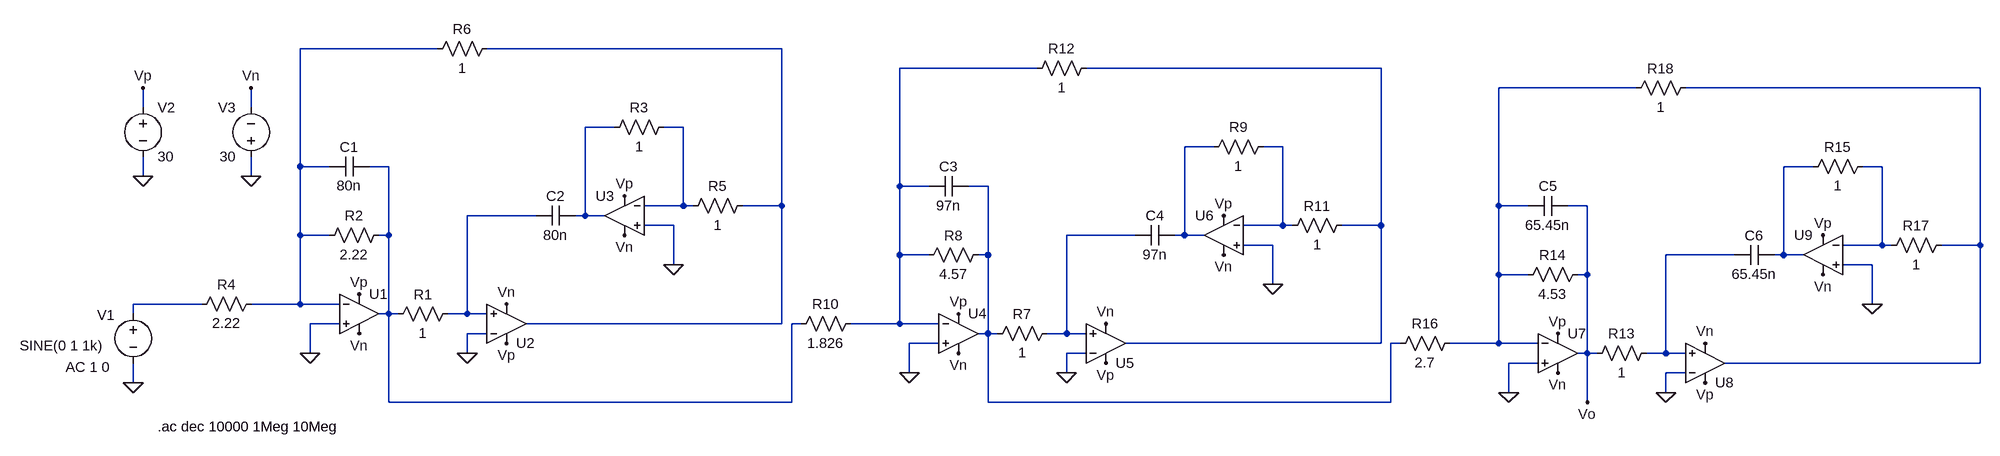
[diagram p0: schematic EJ8.asc]
EJ8.asc, the LTspice schematic file:
Version 4
SHEET 1 2768 680
WIRE 224 -240 0 -240
WIRE 784 -240 304 -240
WIRE 1200 -208 976 -208
WIRE 1760 -208 1280 -208
WIRE 2176 -176 1952 -176
WIRE 2736 -176 2256 -176
WIRE -256 -144 -256 -176
WIRE -80 -144 -80 -176
WIRE 512 -112 464 -112
WIRE 624 -112 592 -112
WIRE 1488 -80 1440 -80
WIRE 1600 -80 1568 -80
WIRE 0 -48 0 -240
WIRE 48 -48 0 -48
WIRE 144 -48 112 -48
WIRE 2464 -48 2416 -48
WIRE 2576 -48 2544 -48
WIRE -256 -32 -256 -64
WIRE -80 -32 -80 -64
WIRE 976 -16 976 -208
WIRE 1024 -16 976 -16
WIRE 1120 -16 1088 -16
WIRE 624 16 624 -112
WIRE 624 16 560 16
WIRE 640 16 624 16
WIRE 784 16 784 -240
WIRE 784 16 720 16
WIRE 1952 16 1952 -176
WIRE 2000 16 1952 16
WIRE 2096 16 2064 16
WIRE 384 32 272 32
WIRE 464 32 464 -112
WIRE 464 32 448 32
WIRE 496 32 464 32
WIRE 608 48 560 48
WIRE 1600 48 1600 -80
WIRE 1600 48 1536 48
WIRE 1616 48 1600 48
WIRE 1760 48 1760 -208
WIRE 1760 48 1696 48
WIRE 0 64 0 -48
WIRE 48 64 0 64
WIRE 144 64 144 -48
WIRE 144 64 128 64
WIRE 1360 64 1248 64
WIRE 1440 64 1440 -80
WIRE 1440 64 1424 64
WIRE 1472 64 1440 64
WIRE 1584 80 1536 80
WIRE 2576 80 2576 -48
WIRE 2576 80 2512 80
WIRE 2592 80 2576 80
WIRE 2736 80 2736 -176
WIRE 2736 80 2672 80
WIRE 976 96 976 -16
WIRE 1024 96 976 96
WIRE 1120 96 1120 -16
WIRE 1120 96 1104 96
WIRE 2336 96 2224 96
WIRE 2416 96 2416 -48
WIRE 2416 96 2400 96
WIRE 2448 96 2416 96
WIRE 608 112 608 48
WIRE 2560 112 2512 112
WIRE 1952 128 1952 16
WIRE 2000 128 1952 128
WIRE 2096 128 2096 16
WIRE 2096 128 2080 128
WIRE 1584 144 1584 80
WIRE -160 176 -272 176
WIRE 0 176 0 64
WIRE 0 176 -80 176
WIRE 64 176 0 176
WIRE 2560 176 2560 112
WIRE -272 192 -272 176
WIRE 144 192 144 64
WIRE 144 192 128 192
WIRE 160 192 144 192
WIRE 272 192 272 32
WIRE 272 192 240 192
WIRE 304 192 272 192
WIRE 64 208 16 208
WIRE 784 208 784 16
WIRE 784 208 368 208
WIRE 816 208 800 208
WIRE 976 208 976 96
WIRE 976 208 896 208
WIRE 1040 208 976 208
WIRE 304 224 272 224
WIRE 1120 224 1120 96
WIRE 1120 224 1104 224
WIRE 1136 224 1120 224
WIRE 1248 224 1248 64
WIRE 1248 224 1216 224
WIRE 1280 224 1248 224
WIRE 1040 240 992 240
WIRE 1760 240 1760 48
WIRE 1760 240 1344 240
WIRE 1792 240 1776 240
WIRE 1952 240 1952 128
WIRE 1952 240 1872 240
WIRE 2016 240 1952 240
WIRE 16 256 16 208
WIRE 272 256 272 224
WIRE 1280 256 1248 256
WIRE 2096 256 2096 128
WIRE 2096 256 2080 256
WIRE 2112 256 2096 256
WIRE 2224 256 2224 96
WIRE 2224 256 2192 256
WIRE 2256 256 2224 256
WIRE 2016 272 1968 272
WIRE 2736 272 2736 80
WIRE 2736 272 2320 272
WIRE 992 288 992 240
WIRE 1248 288 1248 256
WIRE 2256 288 2224 288
WIRE -272 304 -272 272
WIRE 1968 320 1968 272
WIRE 2224 320 2224 288
WIRE 144 336 144 192
WIRE 800 336 800 208
WIRE 800 336 144 336
WIRE 1120 336 1120 224
WIRE 1776 336 1776 240
WIRE 1776 336 1120 336
WIRE 2096 336 2096 256
FLAG 16 256 0
FLAG 272 256 0
FLAG 608 112 0
FLAG -272 304 0
FLAG -256 -32 0
FLAG -80 -32 0
FLAG -256 -176 Vp
FLAG 96 160 Vp
FLAG 528 0 Vp
FLAG 336 240 Vp
FLAG 96 224 Vn
FLAG 528 64 Vn
FLAG 336 176 Vn
FLAG -80 -176 Vn
FLAG 992 288 0
FLAG 1248 288 0
FLAG 1584 144 0
FLAG 1072 192 Vp
FLAG 1504 32 Vp
FLAG 1312 272 Vp
FLAG 1072 256 Vn
FLAG 1504 96 Vn
FLAG 1312 208 Vn
FLAG 1968 320 0
FLAG 2224 320 0
FLAG 2560 176 0
FLAG 2048 224 Vp
FLAG 2480 64 Vp
FLAG 2288 304 Vp
FLAG 2048 288 Vn
FLAG 2480 128 Vn
FLAG 2288 240 Vn
FLAG 2096 336 Vo
SYMBOL OpAmps\\UniversalOpAmp 96 192 R0
SYMATTR InstName U1
SYMATTR Value2 Avol=1000000000Meg GBW=1000000000000Meg Vos=0
SYMATTR SpiceLine En=0 Enk=0 In=0 Ink=0 Rin=500000000Meg
SYMBOL OpAmps\\UniversalOpAmp 336 208 M180
SYMATTR InstName U2
SYMATTR Value2 Avol=1000000000Meg GBW=1000000000000Meg Vos=0
SYMATTR SpiceLine En=0 Enk=0 In=0 Ink=0 Rin=500000000Meg
SYMBOL OpAmps\\UniversalOpAmp 528 32 M0
SYMATTR InstName U3
SYMATTR Value2 Avol=1000000000Meg GBW=1000000000000Meg Vos=0
SYMATTR SpiceLine En=0 Enk=0 In=0 Ink=0 Rin=500000000Meg
SYMBOL res 256 176 R90
WINDOW 0 0 56 VBottom 2
WINDOW 3 32 56 VTop 2
SYMATTR InstName R1
SYMATTR Value 1
SYMBOL res 144 48 R90
WINDOW 0 0 56 VBottom 2
WINDOW 3 32 56 VTop 2
SYMATTR InstName R2
SYMATTR Value 2.22
SYMBOL cap 112 -64 R90
WINDOW 0 0 32 VBottom 2
WINDOW 3 32 32 VTop 2
SYMATTR InstName C1
SYMATTR Value 80n
SYMBOL cap 448 16 R90
WINDOW 0 0 32 VBottom 2
WINDOW 3 32 32 VTop 2
SYMATTR InstName C2
SYMATTR Value 80n
SYMBOL res 608 -128 R90
WINDOW 0 0 56 VBottom 2
WINDOW 3 32 56 VTop 2
SYMATTR InstName R3
SYMATTR Value 1
SYMBOL res -64 160 R90
WINDOW 0 0 56 VBottom 2
WINDOW 3 32 56 VTop 2
SYMATTR InstName R4
SYMATTR Value 2.22
SYMBOL res 736 0 R90
WINDOW 0 0 56 VBottom 2
WINDOW 3 32 56 VTop 2
SYMATTR InstName R5
SYMATTR Value 1
SYMBOL res 320 -256 R90
WINDOW 0 0 56 VBottom 2
WINDOW 3 32 56 VTop 2
SYMATTR InstName R6
SYMATTR Value 1
SYMBOL voltage -272 176 R0
WINDOW 0 -59 18 Left 2
WINDOW 3 -185 68 Left 2
WINDOW 123 -110 103 Left 2
WINDOW 39 0 0 Left 0
SYMATTR InstName V1
SYMATTR Value SINE(0 1 1k)
SYMATTR Value2 AC 1 0
SYMBOL voltage -256 -160 R0
WINDOW 123 0 0 Left 0
WINDOW 39 0 0 Left 0
SYMATTR InstName V2
SYMATTR Value 30
SYMBOL voltage -80 -48 R180
WINDOW 0 24 96 Left 2
WINDOW 3 24 16 Left 2
WINDOW 123 0 0 Left 0
WINDOW 39 0 0 Left 0
SYMATTR InstName V3
SYMATTR Value 30
SYMBOL OpAmps\\UniversalOpAmp 1072 224 R0
SYMATTR InstName U4
SYMATTR Value2 Avol=1000000000Meg GBW=1000000000000Meg Vos=0
SYMATTR SpiceLine En=0 Enk=0 In=0 Ink=0 Rin=500000000Meg
SYMBOL OpAmps\\UniversalOpAmp 1312 240 M180
SYMATTR InstName U5
SYMATTR Value2 Avol=1000000000Meg GBW=1000000000000Meg Vos=0
SYMATTR SpiceLine En=0 Enk=0 In=0 Ink=0 Rin=500000000Meg
SYMBOL OpAmps\\UniversalOpAmp 1504 64 M0
SYMATTR InstName U6
SYMATTR Value2 Avol=1000000000Meg GBW=1000000000000Meg Vos=0
SYMATTR SpiceLine En=0 Enk=0 In=0 Ink=0 Rin=500000000Meg
SYMBOL res 1232 208 R90
WINDOW 0 0 56 VBottom 2
WINDOW 3 32 56 VTop 2
SYMATTR InstName R7
SYMATTR Value 1
SYMBOL res 1120 80 R90
WINDOW 0 0 56 VBottom 2
WINDOW 3 32 56 VTop 2
SYMATTR InstName R8
SYMATTR Value 4.57
SYMBOL cap 1088 -32 R90
WINDOW 0 0 32 VBottom 2
WINDOW 3 32 32 VTop 2
SYMATTR InstName C3
SYMATTR Value 97n
SYMBOL cap 1424 48 R90
WINDOW 0 0 32 VBottom 2
WINDOW 3 32 32 VTop 2
SYMATTR InstName C4
SYMATTR Value 97n
SYMBOL res 1584 -96 R90
WINDOW 0 0 56 VBottom 2
WINDOW 3 32 56 VTop 2
SYMATTR InstName R9
SYMATTR Value 1
SYMBOL res 912 192 R90
WINDOW 0 0 56 VBottom 2
WINDOW 3 32 56 VTop 2
SYMATTR InstName R10
SYMATTR Value 1.826
SYMBOL res 1712 32 R90
WINDOW 0 0 56 VBottom 2
WINDOW 3 32 56 VTop 2
SYMATTR InstName R11
SYMATTR Value 1
SYMBOL res 1296 -224 R90
WINDOW 0 0 56 VBottom 2
WINDOW 3 32 56 VTop 2
SYMATTR InstName R12
SYMATTR Value 1
SYMBOL OpAmps\\UniversalOpAmp 2048 256 R0
SYMATTR InstName U7
SYMATTR Value2 Avol=1000000000Meg GBW=1000000000000Meg Vos=0
SYMATTR SpiceLine En=0 Enk=0 In=0 Ink=0 Rin=500000000Meg
SYMBOL OpAmps\\UniversalOpAmp 2288 272 M180
SYMATTR InstName U8
SYMATTR Value2 Avol=1000000000Meg GBW=1000000000000Meg Vos=0
SYMATTR SpiceLine En=0 Enk=0 In=0 Ink=0 Rin=500000000Meg
SYMBOL OpAmps\\UniversalOpAmp 2480 96 M0
SYMATTR InstName U9
SYMATTR Value2 Avol=1000000000Meg GBW=1000000000000Meg Vos=0
SYMATTR SpiceLine En=0 Enk=0 In=0 Ink=0 Rin=500000000Meg
SYMBOL res 2208 240 R90
WINDOW 0 0 56 VBottom 2
WINDOW 3 32 56 VTop 2
SYMATTR InstName R13
SYMATTR Value 1
SYMBOL res 2096 112 R90
WINDOW 0 0 56 VBottom 2
WINDOW 3 32 56 VTop 2
SYMATTR InstName R14
SYMATTR Value 4.53
SYMBOL cap 2064 0 R90
WINDOW 0 0 32 VBottom 2
WINDOW 3 32 32 VTop 2
SYMATTR InstName C5
SYMATTR Value 65.45n
SYMBOL cap 2400 80 R90
WINDOW 0 0 32 VBottom 2
WINDOW 3 32 32 VTop 2
SYMATTR InstName C6
SYMATTR Value 65.45n
SYMBOL res 2560 -64 R90
WINDOW 0 0 56 VBottom 2
WINDOW 3 32 56 VTop 2
SYMATTR InstName R15
SYMATTR Value 1
SYMBOL res 1888 224 R90
WINDOW 0 0 56 VBottom 2
WINDOW 3 32 56 VTop 2
SYMATTR InstName R16
SYMATTR Value 2.7
SYMBOL res 2688 64 R90
WINDOW 0 0 56 VBottom 2
WINDOW 3 32 56 VTop 2
SYMATTR InstName R17
SYMATTR Value 1
SYMBOL res 2272 -192 R90
WINDOW 0 0 56 VBottom 2
WINDOW 3 32 56 VTop 2
SYMATTR InstName R18
SYMATTR Value 1
TEXT -232 376 Left 2 !.ac dec 10000 1Meg 10Meg

The netlist it stands for:
* EJ8.asc
XU1 0 N001 Vp Vn N011 level1 Avol=1000000000Meg GBW=1000000000000Meg Vos=0 En=0 Enk=0 In=0 Ink=0 Rin=500000000Meg  ; pins In+ In- V+ V- OUT
XU2 N015 0 Vp Vn N002 level1 Avol=1000000000Meg GBW=1000000000000Meg Vos=0 En=0 Enk=0 In=0 Ink=0 Rin=500000000Meg  ; pins In+ In- V+ V- OUT
XU3 0 N008 Vp Vn N007 level1 Avol=1000000000Meg GBW=1000000000000Meg Vos=0 En=0 Enk=0 In=0 Ink=0 Rin=500000000Meg  ; pins In+ In- V+ V- OUT
R1 N015 N011 1
R2 N011 N001 2.22
C1 N011 N001 80n
C2 N007 N015 80n
R3 N008 N007 1
R4 N001 N018 2.22
R5 N002 N008 1
R6 N002 N001 1
V1 N018 0 SINE(0 1 1k) AC 1 0
V2 Vp 0 30
V3 0 Vn 30
XU4 0 N003 Vp Vn N014 level1 Avol=1000000000Meg GBW=1000000000000Meg Vos=0 En=0 Enk=0 In=0 Ink=0 Rin=500000000Meg  ; pins In+ In- V+ V- OUT
XU5 N016 0 Vp Vn N004 level1 Avol=1000000000Meg GBW=1000000000000Meg Vos=0 En=0 Enk=0 In=0 Ink=0 Rin=500000000Meg  ; pins In+ In- V+ V- OUT
XU6 0 N010 Vp Vn N009 level1 Avol=1000000000Meg GBW=1000000000000Meg Vos=0 En=0 Enk=0 In=0 Ink=0 Rin=500000000Meg  ; pins In+ In- V+ V- OUT
R7 N016 N014 1
R8 N014 N003 4.57
C3 N014 N003 97n
C4 N009 N016 97n
R9 N010 N009 1
R10 N003 N011 1.826
R11 N004 N010 1
R12 N004 N003 1
XU7 0 N005 Vp Vn Vo level1 Avol=1000000000Meg GBW=1000000000000Meg Vos=0 En=0 Enk=0 In=0 Ink=0 Rin=500000000Meg  ; pins In+ In- V+ V- OUT
XU8 N017 0 Vp Vn N006 level1 Avol=1000000000Meg GBW=1000000000000Meg Vos=0 En=0 Enk=0 In=0 Ink=0 Rin=500000000Meg  ; pins In+ In- V+ V- OUT
XU9 0 N013 Vp Vn N012 level1 Avol=1000000000Meg GBW=1000000000000Meg Vos=0 En=0 Enk=0 In=0 Ink=0 Rin=500000000Meg  ; pins In+ In- V+ V- OUT
R13 N017 Vo 1
R14 Vo N005 4.53
C5 Vo N005 65.45n
C6 N012 N017 65.45n
R15 N013 N012 1
R16 N005 N014 2.7
R17 N006 N013 1
R18 N006 N005 1
.ac dec 10000 1Meg 10Meg
.lib UniversalOpAmp1.lib
.backanno
.end